# Altium schematic sheet Sheet2.SchDoc
size A4
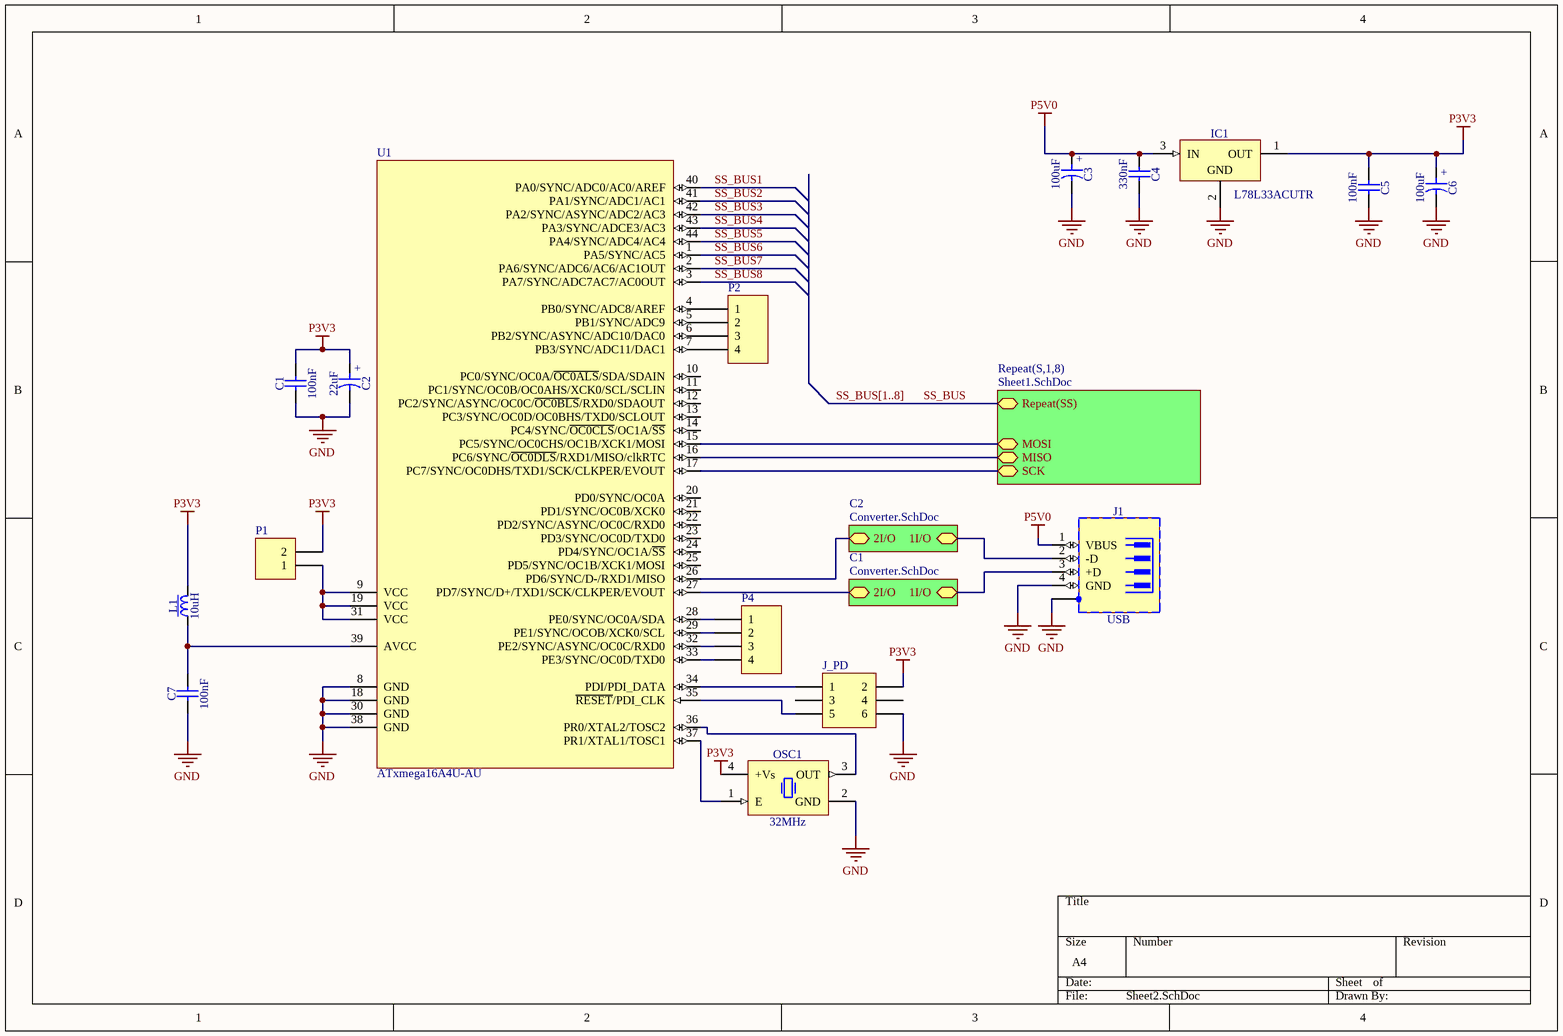
[diagram p0: Sheet2.SchDoc]

## Parts
C1  100nF  [CAPC2012X135N]
C2  22uF  [CAPAE430X540N]
C3  100uF  [CAPAE660X540N]
C4  330nF  [CAPC2012X135N]
C5  100nF  [CAPC2012X135N]
C6  100uF  [CAPAE660X540N]
C7  100nF  [CAPC2012X135N]
IC1  L78L33ACUTR  [SOT89]
J1  USB  [FCI_87520-0010BLF]
J_PD  (no value)  [HDR2X3]
L1  10uH  [IND_MURATA_LQH32]
OSC1  32MHz  [OSC_IQD_CFPS-32]
P1  (no value)  [HDR1X2]
P2  (no value)  [HDR1X4]
P4  (no value)  [HDR1X4]
U1  ATxmega16A4U-AU  [44A_N]

## Sub-sheets
C1 = Converter.SchDoc: 2I/O (bidir), 1I/O (bidir)
C2 = Converter.SchDoc: 2I/O (bidir), 1I/O (bidir)
Repeat(S,1,8) = Sheet1.SchDoc: MOSI (bidir), MISO (bidir), SCK (bidir), Repeat(SS) (bidir)

## Nets
GND: C1.1 C2.2 C3.2 C4.2 C5.2 C6.2 C7.1 IC1.2(GND) J1.4(GND) J1.5(SHIELD) J_PD.6 OSC1.2(GND) U1.8(GND) U1.18(GND) U1.30(GND) U1.38(GND)
P3V3: C1.2 C2.1 C5.1 C6.1 IC1.1(OUT) J_PD.2 L1.2 OSC1.4(+Vs) P1.2
P5V0: C3.1 C4.1 IC1.3(IN) J1.1(VBUS)
SS_BUS: sheet Repeat(S,1,8)/Repeat(SS)
SS_BUS1: U1.40(PA0/SYNC/ADC0/AC0/AREF)
SS_BUS2: U1.41(PA1/SYNC/ADC1/AC1)
SS_BUS3: U1.42(PA2/SYNC/ASYNC/ADC2/AC3)
SS_BUS4: U1.43(PA3/SYNC/ADCE3/AC3)
SS_BUS5: U1.44(PA4/SYNC/ADC4/AC4)
SS_BUS6: U1.1(PA5/SYNC/AC5)
SS_BUS7: U1.2(PA6/SYNC/ADC6/AC6/AC1OUT)
SS_BUS8: U1.3(PA7/SYNC/ADC7AC7/AC0OUT)
NetC7_2: C7.2 L1.1 U1.39(AVCC)
NetJ1_2: J1.2(-D) ; sheet C2/1I/O
NetJ1_3: J1.3(+D) ; sheet C1/1I/O
NetJ_PD_1: J_PD.1 U1.34(PDI/PDI_DATA)
NetJ_PD_5: J_PD.5 U1.35(~{RESET}/PDI_CLK)
NetOSC1_1: OSC1.1(E) U1.37(PR1/XTAL1/TOSC1)
NetOSC1_3: OSC1.3(OUT) U1.36(PR0/XTAL2/TOSC2)
NetP1_1: P1.1 U1.9(VCC) U1.19(VCC) U1.31(VCC)
NetP2_1: P2.1 U1.4(PB0/SYNC/ADC8/AREF)
NetP2_2: P2.2 U1.5(PB1/SYNC/ADC9)
NetP2_3: P2.3 U1.6(PB2/SYNC/ASYNC/ADC10/DAC0)
NetP2_4: P2.4 U1.7(PB3/SYNC/ADC11/DAC1)
NetP4_1: P4.1 U1.28(PE0/SYNC/OC0A/SDA)
NetP4_2: P4.2 U1.29(PE1/SYNC/OCOB/XCK0/SCL)
NetP4_3: P4.3 U1.32(PE2/SYNC/ASYNC/OC0C/RXD0)
NetP4_4: P4.4 U1.33(PE3/SYNC/OC0D/TXD0)
NetU1_15: U1.15(PC5/SYNC/OC0CHS/OC1B/XCK1/MOSI) ; sheet Repeat(S,1,8)/MOSI
NetU1_16: U1.16(PC6/SYNC/~{OC0DLS}/RXD1/MISO/clkRTC) ; sheet Repeat(S,1,8)/MISO
NetU1_17: U1.17(PC7/SYNC/OC0DHS/TXD1/SCK/CLKPER/EVOUT) ; sheet Repeat(S,1,8)/SCK
NetU1_26: U1.26(PD6/SYNC/D-/RXD1/MISO) ; sheet C2/2I/O
NetU1_27: U1.27(PD7/SYNC/D+/TXD1/SCK/CLKPER/EVOUT) ; sheet C1/2I/O

Not connected (* = marked no-connect by the designer): J_PD 3 4; U1 10(PC0/SYNC/OC0A/~{OC0ALS}/SDA/SDAIN) 11(PC1/SYNC/OC0B/OC0AHS/XCK0/SCL/SCLIN) 12(PC2/SYNC/ASYNC/OC0C/~{OC0BLS}/RXD0/SDAOUT) 13(PC3/SYNC/OC0D/OC0BHS/TXD0/SCLOUT) 14(PC4/SYNC/~{OC0CLS}/OC1A/~{SS}) 20(PD0/SYNC/OC0A) 21(PD1/SYNC/OC0B/XCK0) 22(PD2/SYNC/ASYNC/OC0C/RXD0) 23(PD3/SYNC/OC0D/TXD0) 24(PD4/SYNC/OC1A/~{SS}) 25(PD5/SYNC/OC1B/XCK1/MOSI)

## Buses and harness runs
bus SS_BUS[1..8]

## Notes on the sheet
- (in symbol CAE430-540_22UF_10V_20%) +
- (in symbol CAE660-540_100UF_6.3V_20%) +

## Library data of the parts
C1 C5 C7 = CC0805_100NF_50V_10%_X7R: Non-polarised capacitor; Part Description: SMD Multilayer Chip Ceramic Capacitor; Manufacturer: GENERIC; Manufacturer1 Part Number: C2012X7R1H104K085AA; Voltage: 50V; TC: X7R; Tolerance: ±10%; Part Number: CC0805_100NF_50V_10%_X7R; Component Kind: Standard; Component Type: Standard; Pin Count: 2; Value: 100nF; Status: Preferred; Manufacturer Part Number: CC0805_100NF_50V_10%_X7R; Case: 0805; Mounted: Yes; Socket: No; SMD: Yes; Sense: No; Manufacturer1 Example: TDK; Manufacturer1 ComponentHeight: 1mm; HelpURL: \\cern.ch\dfs\Applications\Altium\Datasheets\CC0805_X7R_TDK_C.pdf; Author: CERN DEM JLC; CreateDate: 2007-12-03; LatestRevisionDate: 2015-04-22
C2 = CAE430-540_22UF_10V_20%: Polarised capacitor; Part Description: Aluminum Electrolytic SMT Capacitor; Manufacturer: PANASONIC; Manufacturer Part Number: EEEFK1A220AR; Voltage: 10V; Tolerance: ±20%; Part Number: CAE430-540_22UF_10V_20%; Component Kind: Standard; Component Type: Standard; Pin Count: 2; Value: 22uF; Status: Not Recommended; Case: B; Mounted: Yes; Socket: No; SMD: Yes; Sense: No; ComponentHeight: 5.8mm; HelpURL: \\cern.ch\dfs\Applications\Altium\Datasheets\CAE_PANASONIC_FK.pdf; Author: CERN DEM JLC; CreateDate: 2007-12-03; LatestRevisionDate: 2014-11-05
C3 C6 = CAE660-540_100UF_6.3V_20%: Polarised capacitor; Part Description: Aluminum Electrolytic SMT Capacitor; Manufacturer: PANASONIC; Manufacturer Part Number: EEEFK0J101AP; Voltage: 6.3V; Tolerance: ±20%; Part Number: CAE660-540_100UF_6.3V_20%; Component Kind: Standard; Component Type: Standard; Pin Count: 2; Value: 100uF; Status: Not Recommended; Case: D; Mounted: Yes; Socket: No; SMD: Yes; Sense: No; ComponentHeight: 5.8mm; HelpURL: \\cern.ch\dfs\Applications\Altium\Datasheets\CAE_PANASONIC_FK.pdf; Author: CERN DEM JLC; CreateDate: 2007-12-03; LatestRevisionDate: 2014-11-05
C4 = CC0805_330NF_16V_10%_X7R: Non-polarised capacitor; Part Description: SMD Multilayer Chip Ceramic Capacitor; Manufacturer: GENERIC; Manufacturer1 Part Number: CC0805KKX7R7BB334; Voltage: 16V; TC: X7R; Tolerance: ±10%; Part Number: CC0805_330NF_16V_10%_X7R; Component Kind: Standard; Component Type: Standard; Pin Count: 2; Value: 330nF; Status: Preferred; Manufacturer Part Number: CC0805_330NF_16V_10%_X7R; Case: 0805; Mounted: Yes; Socket: No; SMD: Yes; Sense: No; Manufacturer1 Example: YAGEO; Manufacturer1 ComponentHeight: 1.45mm; HelpURL: \\cern.ch\dfs\Applications\Altium\Datasheets\CC0805_X7R_YAGEO_HIGH CAPACITANCE_MAX50V.pdf; Author: CERN DEM JLC; CreateDate: 2007-12-03; LatestRevisionDate: 2015-04-21
IC1 = L78L33ACUTR: 3-Terminal Regulator 1=OUT 2=GND 3=IN; Part Description: 33V 100mA Positive Voltage Regulator; Manufacturer: ST MICROELECTRONICS; PressFit: No; Bonding: No; Part Number: L78L33ACUTR; Component Kind: Standard; Component Type: Standard; Device: L78L33ACUTR; PackageDescription: SOT89-3, 3-Leads, Body 2.44x4.5mm; Manufacturer Part Number: L78L33ACUTR; Pin Count: 4; Case: SOT89; Mounted: Yes; Socket: No; SMD: Yes; Sense: No; ComponentHeight: 1.6mm; HelpURL: \\cern.ch\dfs\Applications\Altium\Datasheets\L78L33ACUTR.pdf; Author: CERN DEM JLC; CreateDate: 2014-05-12; LatestRevisionDate: 2014-05-12
J1 = FCI_87520-0010BLF: 4 Pin + 1 Shield USB Receptacle; Part Description: USB 2.0 Type A Receptacle, 4 Pins, Right Angle, Shielded; Manufacturer: FCI; PressFit: No; Part Number: FCI_87520-0010BLF; Component Kind: Standard; Component Type: Standard; Pin Count: 6; Family: USB; Mounted: Yes; Socket: No; SMD: No; Sense: No; Status: None; Manufacturer Part Number: 87520-0010BLF; ComponentHeight: 7.7mm; HelpURL: \\cern.ch\dfs\Applications\Altium\Datasheets\FCI_87520-0010BLF.pdf; Author: CERN DEM JMW; CreateDate: 2008-10-06; LatestRevisionDate: 2008-10-06
J_PD = Header 3X2: Header, 3-Pin, Dual row; LatestRevisionDate: 17-Jul-2002; LatestRevisionNote: Re-released for DXP Platform.; Publisher: Altium Limited
L1 = IND_10UH_10%_MURATA_LQH32CN100K33L: Inductor With Core; Part Description: Chip Inductor (Chip Coil) for Choke Wire Wound Type; Manufacturer: MURATA; Power: 450mA; Resistance: 0.3R; Tolerance: ±10%; Part Number: IND_10UH_10%_MURATA_LQH32CN100K33L; Component Kind: Standard; Component Type: Standard; Pin Count: 2; Value: 10uH; Status: None; Manufacturer Part Number: LQH32CN100K33L; Mounted: Yes; Socket: No; SMD: Yes; Sense: No; ComponentHeight: 2.2mm; HelpURL: \\cern.ch\dfs\Applications\Altium\Datasheets\IND_MURATA_LQH32.pdf; Author: CERN DEM JLC; CreateDate: 2009-04-06; LatestRevisionDate: 2012-08-20
OSC1 = OSC_32MHZ_IQD_LFSPXO025916: Oscillator 4 pins 1=E 2=GND 3=OUT 4=+Vs; Part Description: 2.5V, ±50ppm, 15pF, -40 to 85°C, CMOS Surface Mount Clock Oscillator (CFPS-32 Series); Manufacturer: IQD FREQUENCY PRODUCTS; PressFit: No; Bonding: No; Part Number: OSC_32MHZ_IQD_LFSPXO025916; Component Kind: Standard; Component Type: Standard; PackageDescription: Oscillator, Side Concave; 5.08mm Pitch; 4 Pins, 5.00mm L X 7.00mm W X 1.40mm H, CFPS-32 Series; Value: 32MHz; Manufacturer Part Number: LFSPXO025916; Pin Count: 4; Mounted: Yes; Socket: No; SMD: Yes; Sense: No; ComponentHeight: 1.4mm; HelpURL: \\cern.ch\dfs\Applications\Altium\Datasheets\OSC_IQD_LFSPXO025916.pdf; Author: CERN DEM JLC; CreateDate: 2010-12-13; LatestRevisionDate: 2016-11-03
P1 = Header 2: Header, 2-Pin; LatestRevisionDate: 17-Jul-2002; LatestRevisionNote: Re-released for DXP Platform.; Publisher: Altium Limited
P2 P4 = Header 4: Header, 4-Pin; LatestRevisionDate: 17-Jul-2002; LatestRevisionNote: Re-released for DXP Platform.; Publisher: Altium Limited
U1 = ATxmega16A4-AU: 8/16-bit AVR XMEGA A4 Microcontroller, 1.6-3.6V, 16KB + 4KB Flash, 1KB EEPROM, 2KB SRAM, 44-pin TQFP, Industrial Grade (-40°C to 85°C), Pb-Free; Published: 1-Apr-2010; DatasheetVersion: revN, Feb-2010; PackageVersion: rev.B, Oct-2001; PackageReference: 44A; Publisher: Altium Limited; PackageDescription: 44-Pin Plastic Thin Profile Quad Flat Pack, 10 x 10 x 1.0 mm Body, 0.8 mm Pitch (TQFP); Supplier 1: Digi-Key; Supplier Part Number 1: ATXMEGA16A4-AU-ND; Supplier 2: Farnell; Supplier Part Number 2: 1748552; Supplier 3: Mouser; Supplier Part Number 3: 556-ATXMEGA16A4-AU; ComponentLink1Description: Manufacturer Link; ComponentLink1URL: http://www.atmel.com/products/avr/default.asp?; ComponentLink2Description: ATxmega16A4/32A4/64A4/128A4 Datasheet; ComponentLink2URL: http://www.atmel.com/dyn/resources/prod_documents/doc8069.pdf; ComponentLink3Description: Atmel.com Home; ComponentLink3URL: http://www.atmel.com